# EAGLE design powerbrick_v1 (EAGLE 7.2.0)
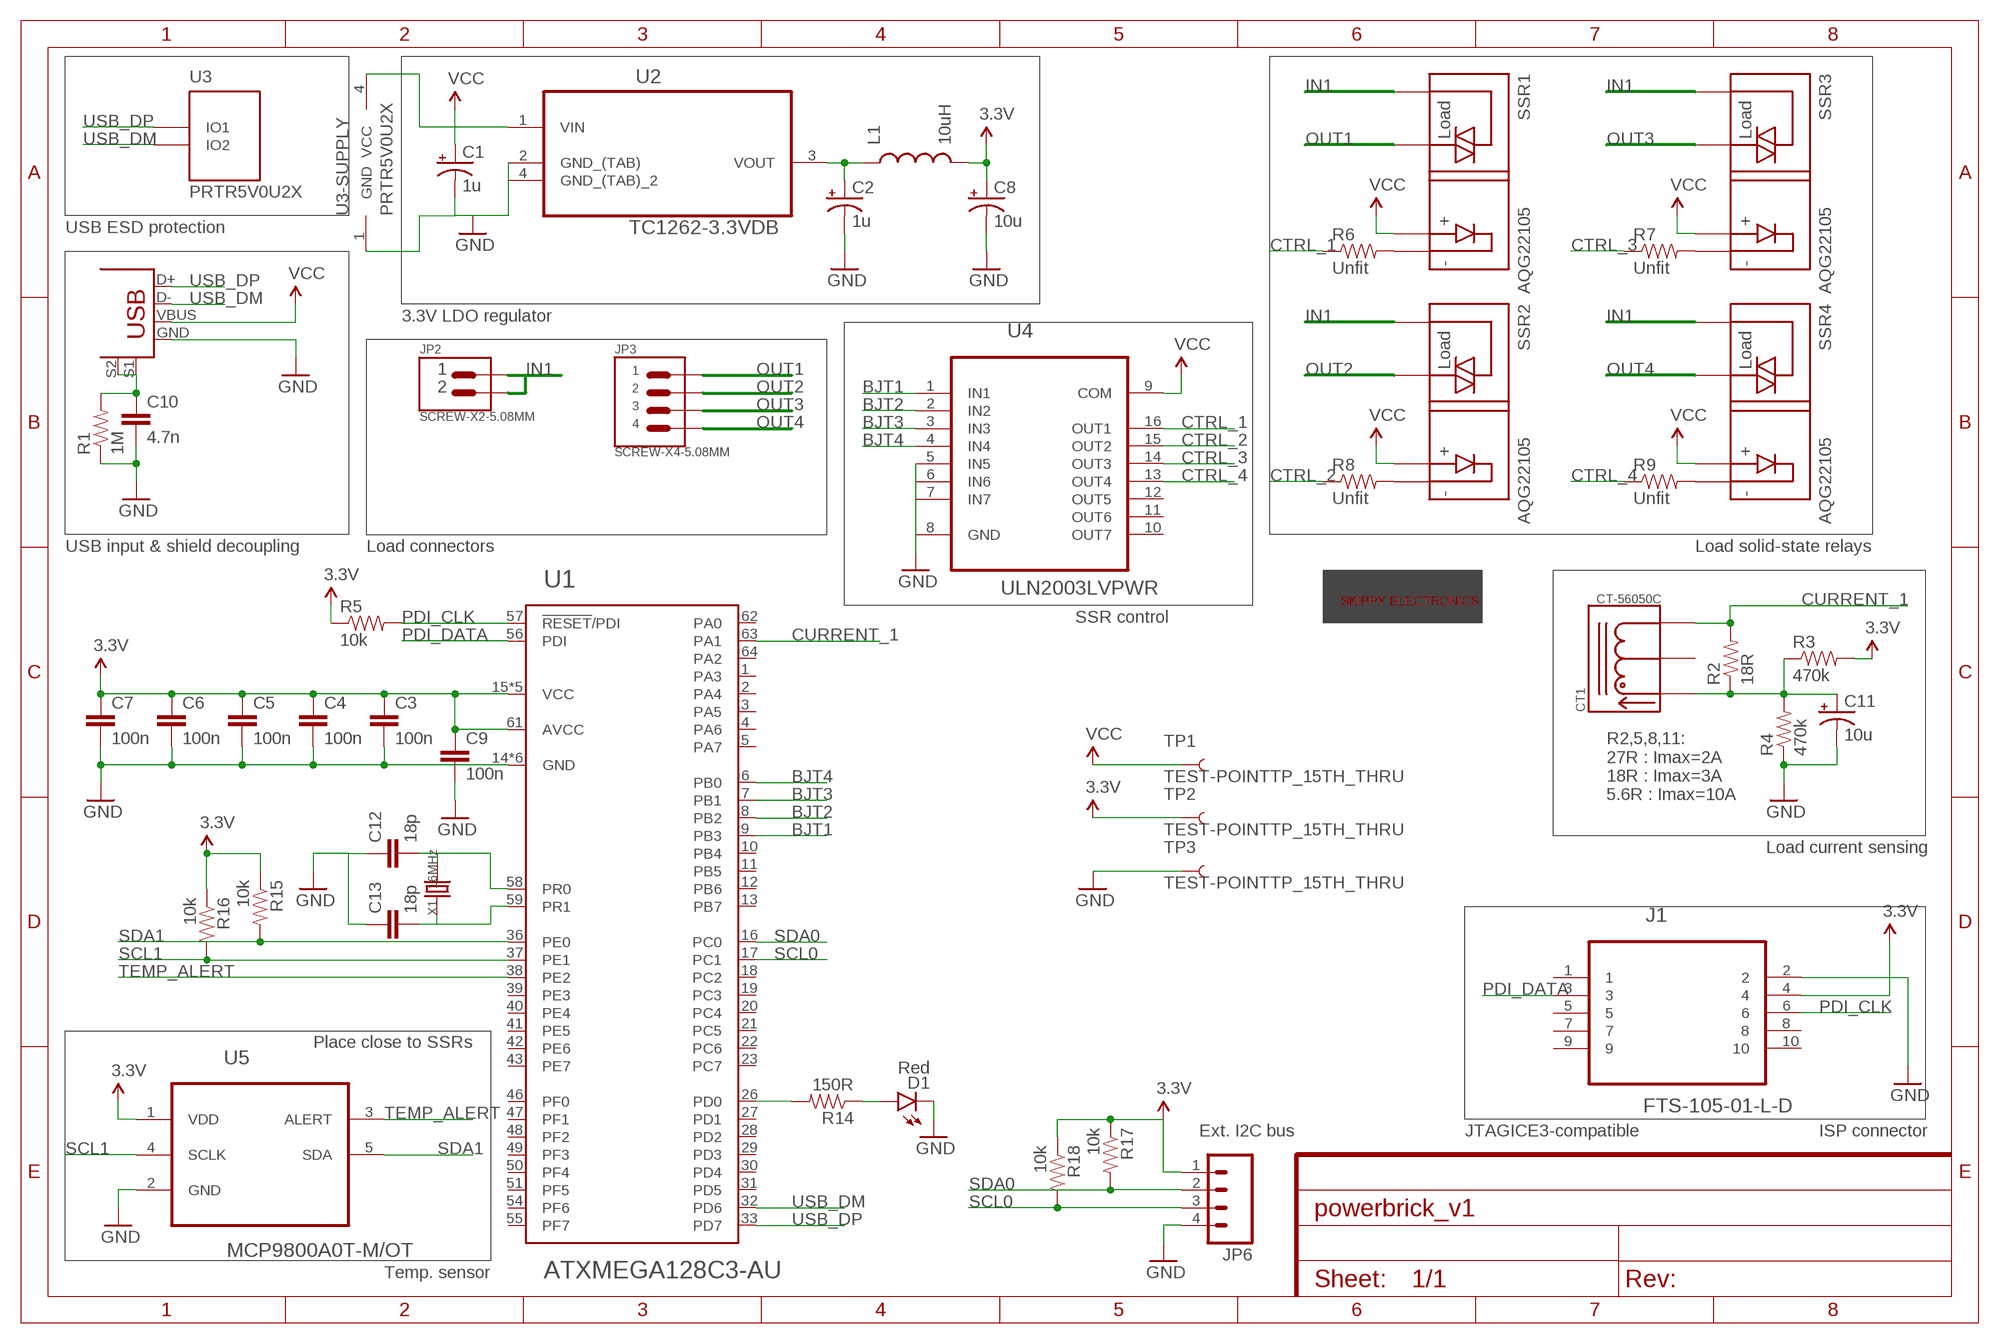
[diagram p0: schematic, sheet 1]
FRAME1 (FRAME-A4L): CNAME: Powerbrick; CREVISION: 1.0; DESIGNER: Christophe Huriaux

## Parts
C1  1u  CAP_POL1206-KIT  [EIA3216-KIT]
C2  1u  CAP_POL1206-KIT  [EIA3216-KIT]
C3  100n  CAP0805  [0805]
C4  100n  CAP0805  [0805]
C5  100n  CAP0805  [0805]
C6  100n  CAP0805  [0805]
C7  100n  CAP0805  [0805]
C8  10u  CAP_POL1206-KIT  [EIA3216-KIT]
C9  100n  CAP0805  [0805]
C10  4.7n  CAP0805  [0805]
C11  10u  CAP_POL1206-KIT  [EIA3216-KIT]
C12  18p  CAP0805  [0805]
C13  18p  CAP0805  [0805]
CT1  CT-56050C  [CT-56050C]
D1  Red  LED5MM  [LED5MM]
J1  FTS-105-01-L-D  [SAMTEC_FTS-105-01-L-D]
JP1  USB+SHIELD  [USB-B-PTH]
JP2  SCREW-X2-5.08MM  [1X02-5.08MM]
JP3  SCREW-X4-5.08MM  [1X04]
JP6  M04POLAR_LOCK  [MOLEX-1X4_LOCK]
L1  10uH  INDUCTORBOURNS_SRN6045  [SRN6045]
R1  1M  RESISTOR0805-RES  [0805]
R2  18R  RESISTOR2512  [R2512]
R3  470k  RESISTOR0805-RES  [0805]
R4  470k  RESISTOR0805-RES  [0805]
R5  10k  RESISTOR0805-RES  [0805]
R6  Unfit  RESISTOR0805-RES  [0805]
R7  Unfit  RESISTOR0805-RES  [0805]
R8  Unfit  RESISTOR0805-RES  [0805]
R9  Unfit  RESISTOR0805-RES  [0805]
R14  150R  RESISTOR0805-RES  [0805]
R15  10k  RESISTOR0805-RES  [0805]
R16  10k  RESISTOR0805-RES  [0805]
R17  10k  RESISTOR0805-RES  [0805]
R18  10k  RESISTOR0805-RES  [0805]
SSR1  AQG22105  [SSR-100-400-300]
SSR2  AQG22105  [SSR-100-400-300]
SSR3  AQG22105  [SSR-100-400-300]
SSR4  AQG22105  [SSR-100-400-300]
TP1  TEST-POINTTP_15TH_THRU  [TP_15TH]
TP2  TEST-POINTTP_15TH_THRU  [TP_15TH]
TP3  TEST-POINTTP_15TH_THRU  [TP_15TH]
U1  ATXMEGA128C3-AU  [TQFP-64A-64]
U2  TC1262-3.3VDB  [SOT230P700X180-4N]
U3  PRTR5V0U2X  [SOT-143B]
U4  ULN2003LVPWR  [SOP65P640X120-16N]
U5  MCP9800A0T-M/OT  [SOT95P280X145-5N]
U$2  SKIPPYTXT-PLC-10MM  [SKIPPYTXT-PLC-10MM]
X1  16MHz  CRYSTAL'HC49S'  [HC49S]

## Nets
3.3V: C3.1 C4.1 C5.1 C6.1 C7.1 C8.A(+) C9.1 J1.4 JP6.1 L1.2 R3.2 R5.1 R15.1 R16.1 R17.1 R18.1 TP2.P$1 U1.15(VCC) U1.25(VCC) U1.35(VCC) U1.45(VCC) U1.53(VCC) U1.61(AVCC) U5.1(VDD)
BJT1: U1.9(PB3) U4.1(IN1)
BJT2: U1.8(PB2) U4.2(IN2)
BJT3: U1.7(PB1) U4.3(IN3)
BJT4: U1.6(PB0) U4.4(IN4)
CTRL_1: R6.1 U4.16(OUT1)
CTRL_2: R8.1 U4.15(OUT2)
CTRL_3: R7.1 U4.14(OUT3)
CTRL_4: R9.1 U4.13(OUT4)
CURRENT_1: CT1.P$3 R2.2 U1.63(PA1)
GND: C1.C(-) C2.C(-) C3.2 C4.2 C5.2 C6.2 C7.2 C8.C(-) C9.2 C10.2 C11.C(-) C12.1 C13.1 D1.K(C) J1.2 JP1.GND JP6.4 R1.1 R4.1 TP3.P$1 U1.14(GND) U1.24(GND) U1.34(GND) U1.44(GND) U1.52(GND) U1.60(GND) U2.2(GND_(TAB)) U2.4(GND_(TAB)_2) U3.1(GND) U4.5(IN5) U4.6(IN6) U4.7(IN7) U4.8(GND) U5.2(GND)
IN1: JP2.P$1 JP2.P$2 SSR1.P$4 SSR2.P$4 SSR3.P$4 SSR4.P$4
N$1: C12.2 U1.58(PR0) X1.2
N$2: C2.A(+) L1.1 U2.3(VOUT)
N$3: C13.2 U1.59(PR1) X1.1
N$4: C11.A(+) CT1.P$1 R2.1 R3.1 R4.2
N$5: C10.1 JP1.S1 JP1.S2 R1.2
N$6: R6.2 SSR1.P$1
N$9: R7.2 SSR3.P$1
N$10: R9.2 SSR4.P$1
N$11: R14.2 U1.26(PD0)
N$12: D1.A R14.1
N$13: R8.2 SSR2.P$1
OUT1: JP3.P$1 SSR1.P$3
OUT2: JP3.P$2 SSR2.P$3
OUT3: JP3.P$3 SSR3.P$3
OUT4: JP3.P$4 SSR4.P$3
PDI_CLK: J1.6 R5.2 U1.57(!RESET!/PDI)
PDI_DATA: J1.3 U1.56(PDI)
SCL0: JP6.3 R18.2 U1.17(PC1)
SCL1: R16.2 U1.37(PE1) U5.4(SCLK)
SDA0: JP6.2 R17.2 U1.16(PC0)
SDA1: R15.2 U1.36(PE0) U5.5(SDA)
TEMP_ALERT: U1.38(PE2) U5.3(ALERT)
USB_DM: JP1.D- U1.32(PD6) U3.3(IO2)
USB_DP: JP1.D+ U1.33(PD7) U3.2(IO1)
VCC: C1.A(+) JP1.VBUS SSR1.P$2 SSR2.P$2 SSR3.P$2 SSR4.P$2 TP1.P$1 U2.1(VIN) U3.4(VCC) U4.9(COM)
Unconnected: CT1.P$2 J1.1 J1.5 J1.7 J1.8 J1.9 J1.10 U1.1(PA3) U1.2(PA4) U1.3(PA5) U1.4(PA6) U1.5(PA7) U1.10(PB4) U1.11(PB5) U1.12(PB6) U1.13(PB7) U1.18(PC2) U1.19(PC3) U1.20(PC4) U1.21(PC5) U1.22(PC6) U1.23(PC7) U1.27(PD1) U1.28(PD2) U1.29(PD3) U1.30(PD4) U1.31(PD5) U1.39(PE3) U1.40(PE4) U1.41(PE5) U1.42(PE6) U1.43(PE7) U1.46(PF0) U1.47(PF1) U1.48(PF2) U1.49(PF3) U1.50(PF4) U1.51(PF5) U1.54(PF6) U1.55(PF7) U1.62(PA0) U1.64(PA2) U4.10(OUT7) U4.11(OUT6) U4.12(OUT5)

## Notes on the sheet
- USB ESD protection
- 3.3V LDO regulator
- USB input & shield decoupling | Load connectors | Load solid-state relays
- SSR control
- R2,5,8,11:
  27R : Imax=2A
  18R : Imax=3A
  5.6R : Imax=10A
- Load current sensing
- Place close to SSRs
- Ext. I2C bus | JTAGICE3-compatible | ISP connector
- Temp. sensor

## Library data of the parts
C1 C2 = SparkFun-Capacitors:CAP_POL: Capacitor Polarized These are standard SMD and PTH capacitors. Normally 10uF, 47uF, and 100uF in electrolytic and tantalum varieties. Always verify the external diameter of the through hole cap, it varies with capacity, voltage, and manufacturer. The EIA devices should be standard.; OC_FARNELL: 1135123
C3-C7 C9 C10 C12 C13 = SparkFun-Capacitors:CAP: Capacitor Standard 0603 ceramic capacitor, and 0.1" leaded capacitor.
C8 C11 = SparkFun-Capacitors:CAP_POL: Capacitor Polarized These are standard SMD and PTH capacitors. Normally 10uF, 47uF, and 100uF in electrolytic and tantalum varieties. Always verify the external diameter of the through hole cap, it varies with capacity, voltage, and manufacturer. The EIA devices should be standard.
CT1 = Skippy-Discrete:CT-56050C; OC_FARNELL: 2291968
D1 = SparkFun-LED:LED: LEDs Standard schematic elements and footprints for 5mm, 3mm, 1206, and 0603 sized LEDs. 5mm - Spark Fun Electronics SKU : COM-00529 (and others); OC_FARNELL: 2112111
J1 = Skippy-Connectors:FTS-105-01-L-D; OCFARNELL: 1577743
JP1 = SparkFun-Connectors:USB+SHIELD: USB+Shield USB connector with shield pins connectable; OC_FARNELL: 1097897
JP2 = Skippy-Connectors:SCREW-X2-5.08MM; OC_FARNELL: 2315273
JP3 = Skippy-Connectors:SCREW-X4-5.08MM; OC_FARNELL: 2315275
JP6 = SparkFun-Connectors:M04: Header 4 Standard 4-pin 0.1" header. Use with straight break away headers (SKU : PRT-00116), right angle break away headers (PRT-00553), swiss pins (PRT-00743), machine pins (PRT-00117), and female headers (PRT-00115). Molex polarized connector foot print use with SKU : PRT-08231 with associated crimp pins and housings. 1MM SMD Version SKU: PRT-10208
L1 = SparkFun-Passives:INDUCTOR: Inductors Basic Inductor/Choke - 0603 and 1206. Footprints are not proven and vary greatly between part numbers. SRN6045- 33uH, 20% 1.4A SDR0403-560KL - 56uH, 10%, 500mA RMS/740mA peak; OC_FARNELL: 2061652; PROD_ID: NDUC-11627; VALUE: 33uH
R1 R3-R9 R14-R18 = SparkFun-Passives:RESISTOR: Resistor Basic schematic elements and footprints for 0603, 1206, and PTH resistors.
R2 = SparkFun-Passives:RESISTOR: Resistor Basic schematic elements and footprints for 0603, 1206, and PTH resistors.; OC_FARNELL: 1717969
SSR1-SSR4 = Skippy-Discrete:AQG22105; OC_FARNELL: 2095710
TP1-TP3 = SparkFun-Passives:TEST-POINT: Bare copper test points for troubleshooting or ICT
U1 = atmel-xmega:ATXMEGA128C3: 8/16-bit XMEGA C3 Microcontroller Features High-performance, low-power Atmel® AVR® XMEGA® 8/16-bit Microcontroller Nonvolatile program and data memories – 64K - 256KBytes of In-System Self-Programmable Flash – 4K - 8KBytes Boot Code Section with Independent Lock Bits – 2K - 4KBytes EEPROM – 4K - 16KBytes Internal SRAM Peripheral features – Four-channel event system – Five 16-bit timer/counters Four timer/counters with four output compare or input capture channels One timer/counter with two output compare or input capture channels High resolution extension on two timer/counters Advanced waveform extension (AWeX) on one timer/counter – One USB device interface USB 2.0 full speed (12Mbps) and low speed (1.5Mbps) device compliant 32 Endpoints with full configuration flexibility – Three USARTs with IrDA support for one USART – Two two-wire interfaces with dual address match (I2C and SMBus compatible) – Two serial peripheral interfaces (SPIs) – CRC-16 (CRC-CCITT) and CRC-32 (IEEE®802.3) generator – 16-bit real time counter (RTC) with separate oscillator – One sixteen-channel, 12-bit, 300ksps Analog to Digital Converter – Two Analog Comparators with window compare function, and current sources – External interrupts on all general purpose I/O pins – Programmable watchdog timer with separate on-chip ultra low power oscillator – QTouch® library support Capacitive touch buttons, sliders and wheels Special microcontroller features – Power-on reset and programmable brown-out detection – Internal and external clock options with PLL and prescaler – Programmable multilevel interrupt controller – Five sleep modes – Programming and debug interface PDI (program and debug interface) I/O and packages – 50 programmable I/O pins – 64-lead TQFP – 64-pad QFN Operating voltage – 1.6 – 3.6V Operating frequency – 0 – 12MHz from 1.6V – 0 – 32MHz from 2.7V; OC_FARNELL: 2353909
U2 = Skippy-IC:TC1262-3.3VDB: IC, 500mA Fixed Output CMOS LDO,3.3V,SOT-223, 3-lead; MPN: TC1262-3.3VDB; OC_FARNELL: 1852183; OC_NEWARK: 53R0370; PACKAGE: SOT-223-3; SUPPLIER: Microchip
U3 = NXPSemiconductors:PRTR5V0U2X?: I2C-Bus EDS Protection Ulta low capacitance double rail-to-rail ESD protection diode Documentation Datasheet <http://www.nxp.com/documents/data_sheet/PRTR5V0U2X.pdf> General Description Ultra low capacitance rail-to-rail ElectroStatic Discharge (ESD) protection diode in a small SOT143B Surface-Mounted Device (SMD) plastic package designed to protect two Hi-Speed data lines or high-frequency signal lines from the damage caused by ESD and other transients. PRTR5V0U2X incorporates two pairs of ultra low capacitance rail-to-rail diodes as well as an additional ESD protection diode to ensure signal line protection even if no supply voltage is available. Features ESD protection of two Hi-Speed data lines or high-frequency signal lines Ultra low input/output to ground capacitance: C(I/O-GND) = 1 pF ESD protection up to 8kV IEC 61000-4-2, level 4 (ESD) Very low clamping voltage due to an integrated additional ESD protection diode Very low reverse current Small SMD plastic package Applications USB 2.0 ports Digital Video Interface (DVI)/High Definition Multimedia Interface (HDMI) interfaces Mobile and cordless phones Personal Digital Assistants (PDA) Digital Cameras Wide Area Network (WAN) / Local Area Network (LAN) systems PCs, notebooks, printers, and other PC peripherals
U4 = Skippy-IC:ULN2003LVPWR: 7-Channel Relay and Inductive Load Sink Driver,TSSOP-16; OC_FARNELL: 2296010
U5 = Skippy-IC:MCP9800A0T-M/OT: Temperature Sensor; OC_FARNELL: 1439485
U$2 = skippy-logo:SKIPPYTXT-PLC-10MM
X1 = Discrete:CRYSTAL*: CRYSTAL

## Net classes
1 hv: width 3.81 mm, clearance 3.048 mm

## Board
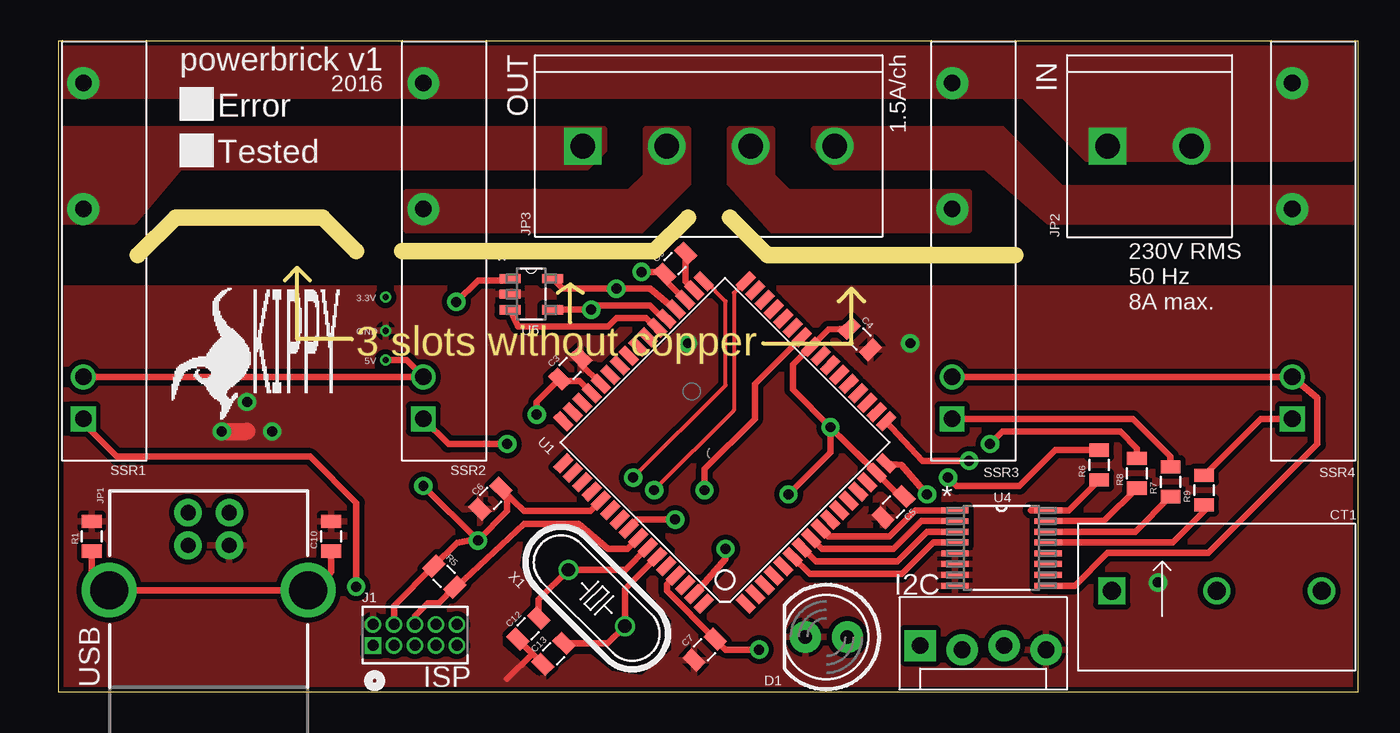
[diagram p1: board, top side]
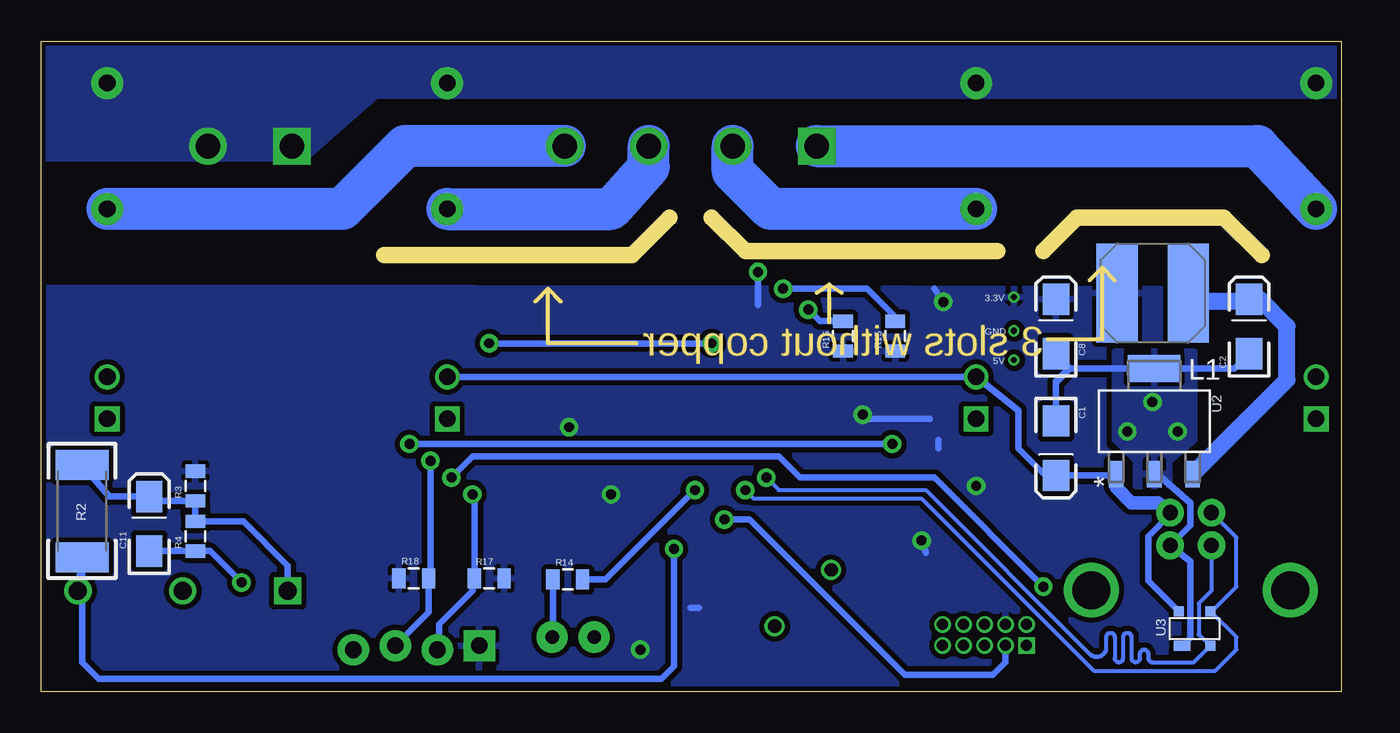
[diagram p2: board, bottom side, seen from below]

Size 78.66 x 39.36 mm. Coordinates in mm from the lower left corner, seen from the top.
Outline: 0,0 78.66,0 78.66,39.36 0,39.36 0,0
Copper layers (1*2*15*16): Top 0.035mm / dielectric 0.2mm / layer 2 0.0175mm / dielectric 1.1mm / layer 15 0.0175mm / dielectric 0.2mm / Bottom 0.035mm
Design rules "SeeedStudio_DRU_no_angle_20130527 *": minimum track width 6mil, minimum drill 12mil, track to track 6mil, track to pad 6mil, pad to pad 6mil, via to via 6mil, smd to smd 0mil, copper to edge 10mil, drill to drill 10mil, minimum pad ring 6mil, minimum via ring 10mil, stop-mask expansion 2mil, vias tented up to drill 25mil, thermal gap 10mil
Milling: 18 lines

### Footprints (pad centres in the part's own frame; a part is rotated, then mirrored left to right if it is on the bottom)
EIA3216-KIT = smd 1.9 x 1.6: A 1.65,0; C -1.65,0
0805 = smd 0.8 x 1.2: 1 -0.9,0; 2 0.9,0
CT-56050C = drill 1.1 square: P$1 -6.35,0 | drill 1.1: P$2 0,0; P$3 6.35,0
LED5MM = drill 0.813 pad 1.88: A -1.27,0; K 1.27,0
SAMTEC_FTS-105-01-L-D = drill 0.66 square: 1 -5.08,-1.27 | drill 0.66: 2 -5.08,0; 3 -3.81,-1.27; 4 -3.81,0; 5 -2.54,-1.27; 6 -2.54,0; 7 -1.27,-1.27; 8 -1.27,0; 9 0,-1.27; 10 0,0
USB-B-PTH = drill 0.914 pad 1.676: D+ 0,1.25; D- 1.981,1.25; GND 0,-1.25; VBUS 1.981,-1.25 | drill 2.286: S1 -2.718,-6.02; S2 -2.718,6.02
1X02-5.08MM = drill 1.5 square: P$1 -2.54,0 | drill 1.5: P$2 2.54,0
1X04 = drill 1.5 square: P$1 -7.62,0 | drill 1.5: P$2 -2.54,0; P$3 2.54,0; P$4 7.62,0
MOLEX-1X4_LOCK = drill 1.016 pad 1.88 square: 1 0,0.127 | drill 1.016 pad 1.88: 2 2.54,-0.127; 3 5.08,0.127; 4 7.62,-0.127
SRN6045 = smd 2.5 x 6: 1 -2.175,-0.175; 2 2.125,-0.175
R2512 = smd 1.8 x 3.2: 1 -2.8,0; 2 2.8,0
SSR-100-400-300 = drill 1 square: P$1 -10.16,0 | drill 1: P$2 -7.62,0 | drill 1 pad 1.93: P$3 2.54,0; P$4 10.16,0
TP_15TH = drill 0.381 pad 0.61: P$1 0,0
TQFP-64A-64 = smd 1.194 x 0.559: 1 -7.8,6; 2 -7.8,5.2; 3 -7.8,4.4; 4 -7.8,3.6; 5 -7.8,2.8; 6 -7.8,2; 7 -7.8,1.2; 8 -7.8,0.4; 9 -7.8,-0.4; 10 -7.8,-1.2; 11 -7.8,-2; 12 -7.8,-2.8; 13 -7.8,-3.6; 14 -7.8,-4.4; 15 -7.8,-5.2; 16 -7.8,-6; 33 7.8,-6; 34 7.8,-5.2; 35 7.8,-4.4; 36 7.8,-3.6; 37 7.8,-2.8; 38 7.8,-2; 39 7.8,-1.2; 40 7.8,-0.4; 41 7.8,0.4; 42 7.8,1.2; 43 7.8,2; 44 7.8,2.8; 45 7.8,3.6; 46 7.8,4.4; 47 7.8,5.2; 48 7.8,6 | smd 0.559 x 1.194: 17 -6,-7.8; 18 -5.2,-7.8; 19 -4.4,-7.8; 20 -3.6,-7.8; 21 -2.8,-7.8; 22 -2,-7.8; 23 -1.2,-7.8; 24 -0.4,-7.8; 25 0.4,-7.8; 26 1.2,-7.8; 27 2,-7.8; 28 2.8,-7.8; 29 3.6,-7.8; 30 4.4,-7.8; 31 5.2,-7.8; 32 6,-7.8; 49 6,7.8; 50 5.2,7.8; 51 4.4,7.8; 52 3.6,7.8; 53 2.8,7.8; 54 2,7.8; 55 1.2,7.8; 56 0.4,7.8; 57 -0.4,7.8; 58 -1.2,7.8; 59 -2,7.8; 60 -2.8,7.8; 61 -3.6,7.8; 62 -4.4,7.8; 63 -5.2,7.8; 64 -6,7.8
SOT230P700X180-4N = smd 1.626 x 0.889: 1 -3.2,2.311; 2 -3.2,0; 3 -3.2,-2.311 | smd 1.626 x 3.175: 4 3.2,0
SOT-143B = smd 1 x 0.6: 1 -0.75,-1.05 | smd 0.6 x 0.6: 2 0.95,-1.05; 3 0.95,1.05; 4 -0.95,1.05
SOP65P640X120-16N = smd 1.651 x 0.356: 1 -2.819,2.286; 2 -2.819,1.626; 3 -2.819,0.965; 4 -2.819,0.33; 5 -2.819,-0.33; 6 -2.819,-0.965; 7 -2.819,-1.626; 8 -2.819,-2.286; 9 2.819,-2.286; 10 2.819,-1.626; 11 2.819,-0.965; 12 2.819,-0.33; 13 2.819,0.33; 14 2.819,0.965; 15 2.819,1.626; 16 2.819,2.286
SOT95P280X145-5N = smd 1.27 x 0.559: 1 -1.295,0.94; 2 -1.295,0; 3 -1.295,-0.94; 4 1.295,-0.94; 5 1.295,0.94
HC49S = drill 0.813: 1 -2.413,0; 2 2.413,0

### Placement (x,y rotation side)
C1  17.27,14.73 270 bottom
C2  5.59,22.1 90 bottom
C3  30.99,19.56 45 top
C4  48.51,21.34 315 top
C5  50.55,11.18 225 top
C6  26.16,11.68 225 top
C7  39.12,2.54 225 top
C8  17.27,22.1 90 bottom
C9  37.34,25.91 45 top
C10  16.51,9.4 90 top
C11  72.14,10.16 90 bottom
C12  28.45,3.81 45 top
C13  29.97,2.29 45 top
CT1  70.1,6.1 0 top
D1  46.48,3.3 180 top
J1  24.13,4.06 0 top
JP1  9.11,8.85 90 top
JP2  66.04,33.02 0 top
JP3  39.37,33.02 0 top
JP6  52.16,2.66 0 top
L1  11.44,23.95 180 bottom
R1  2.03,9.4 270 top
R2  76.2,10.92 270 bottom
R3  69.34,12.45 90 bottom
R4  69.34,9.4 90 bottom
R5  23.37,6.96 315 top
R6  62.99,13.72 90 top
R7  67.31,12.7 90 top
R8  65.28,13.21 90 top
R9  69.34,12.19 90 top
R14  46.81,6.78 0 bottom
R15  27,21.52 90 bottom
R16  30.15,21.52 90 bottom
R17  51.56,6.86 180 bottom
R18  56.13,6.86 0 bottom
SSR1  1.52,26.67 90 top
SSR2  22.1,26.67 90 top
SSR3  54.1,26.67 90 top
SSR4  74.68,26.67 90 top
TP1  19.81,20.07 0 top
TP2  19.81,23.88 0 top
TP3  19.81,21.84 0 top
U1  40.34,15.08 135 top
U2  11.32,16.36 90 bottom
U3  8.89,3.81 0 bottom
U4  57.08,8.69 0 top
U5  28.63,24.06 0 top
U$2  6.93,16.53 0 top
X1  32.59,5.66 135 top

### Tracks (layer width: path | path; a pad name or v marks a point on that pad's centre or on a via)
3.3V  (via drill 0.6)
  Top 0.406: C4.1 46.61,21.92 U1.25 45.52,20.88 44.45,19.81 44.45,18.29 v46.74,16 | v46.74,16 48.81,13.97 U1.15 49.53,13.21 50.29,12.45 50.8,11.94 C5.1 50.93,11.81 v46.74,16 | U1.61 36.83,6.48 36.83,6.1 C7.1 | C7.1 | C7.1 40.39,2.54 v42.42,2.54 | v35.31,25.4 36.58,25.4 C9.1 36.7,24.95 U1.35 | U1.45 31.54,18.8 30.48,18.8 C3.1 28.96,17.53 v28.96,16.76 | J1.4 20.32,5.19 R5.1 24.13,9 24.89,9.14 v25.4,9.14 | U1.53 32.22,10.92 28.19,10.92 27.56,11.56 27.18,11.94 | 27.18,11.94 C6.1 | U5.1 27.23,24.89 25.4,24.89 v24.09,23.58 | v25.4,9.14 27.18,10.92 27.18,11.94 | v22.1,12.45 v25.4,9.14 | v46.74,16 46.74,14.48 v44.2,11.94
  Bottom 0.406: v28.96,16.76 28.96,16.51 24.89,16.51 | 38.86,5.08 39.37,5.08 | v42.42,2.54 42.67,2.54 | v25.4,9.14 25.15,8.38 | v35.31,25.4 35.29,23.4 | v24.09,23.58 24.64,24.38 | 24.38,15.24 24.38,14.73 | v44.2,11.94 44.45,11.68
  pour Bottom (isolate 0.305, rank 6): 0,0 78.74,0 78.44,24.45 0,24.35
BJT1
  Top 0.406: U1.9 46.59,9.4 50.29,9.4 51.87,10.98 U4.1
BJT2
  Top 0.406: U1.8 46.22,8.64 50.55,8.64 52.23,10.32 U4.2
BJT3
  Top 0.406: U1.7 45.85,7.87 50.8,7.87 52.58,9.66 U4.3
BJT4
  Top 0.406: U1.6 45.48,7.11 51.05,7.11 52.96,9.02 U4.4
CTRL_1
  Top 0.406: 58.87,10.98 U4.16 61.15,10.98 R6.1
CTRL_2
  Top 0.406: U4.15 63.29,10.32 R8.1
CTRL_3
  Top 0.406: U4.14 65.17,9.66 R7.1
CTRL_4
  Top 0.406: U4.13 67.44,9.02 69.34,10.92 R9.1
CURRENT_1  (via drill 0.6)
  Top 0.406: v40.39,8.64 40.39,8.03 U1.63
  Bottom 0.406: CT1.P$3 R2.2 76.2,1.78 75.18,0.76 41.15,0.76 40.39,1.52 v40.39,8.64
GND  (via drill 0.6)
  Top 0.406: v66.55,6.6 66.55,6.35 | C13.1 C12.1 28.7,2.29 27.18,0.76 | U1.44 31.62,19.84 C3.2 | U1.34 37.97,24.8 C9.2
  Top 1.016: v9.91,15.75 11.43,15.75
  Bottom 0.406: U3.1 9.14,3.26 9.14,7.87 10.38,8.85 JP1.GND 9.14,10.07 9.14,11.43 11.13,13.16 U2.2 | C2.C 6.48,19.56 U2.4 16.38,19.56 | 16.38,19.56 C8.C | 16.38,19.56 17.27,18.67 C1.C 17.27,18.8 16.51,19.56 11.43,19.56 | C11.C 69.35,8.51 | 69.35,8.51 R4.1 | 69.35,8.51 68.45,8.51 v66.55,6.6 | v38.1,21.08 v51.56,21.08
  other vias: 12.95,15.75 11.43,17.53
  pour Top (isolate 0.305, rank 6): 0,0 78.74,0 78.49,24.38 0,24.38
  cutout Top (isolate 0.254, no thermals): 36.07,9.65 34.54,8.13 33.53,8.13 31.24,10.16 29.46,10.16 28.19,9.14 27.94,7.62 28.7,6.1 28.7,5.33 26.92,3.56 26.92,2.79 28.96,1.02 29.72,1.02 31.24,2.29 32.26,2.29 33.53,1.27 35.31,1.02 37.08,2.54 37.08,4.32 35.56,6.1 35.56,6.86 37.34,8.64 36.32,9.65
  pour Bottom: 10.41,12.45 12.45,12.45 12.45,13.97 13.72,15.24 13.72,20.57 8.89,20.57 8.89,15.24 10.41,13.97
IN1
  pour Bottom (no thermals): 0.25,39.12 0.25,36.07 58.42,36.07 62.74,32.26 78.49,32.26 78.49,39.12
  pour Top (no thermals): 0.25,38.86 0.25,36.07 58.42,36.07 62.23,32.26 78.23,32.26 78.23,39.12 0.51,39.12
N$1
  Top 0.406: U1.58 34.32,7.37 X1.2 29.08,5.57 C12.2
N$2
  Bottom 0.406: U2.3 8.89,13.28 | 8.89,23.62 9.27,24 L1.1
  Bottom 1.016: 8.89,13.28 3.3,18.87 3.3,22.1 4.95,23.75 C2.A 5.71,23.62 8.89,23.62
N$3
  Top 0.406: U1.59 34.29,6.21 X1.1 33.26,2.92 C13.2
N$4
  Bottom 0.406: CT1.P$1 63.75,7.62 66.43,10.3 R4.2 R3.1 71.87,11.55 C11.A 74.54,11.81 R2.1
N$5
  Top 0.406: R1.2 2.03,7.19 JP1.S2 JP1.S1 16.51,7.26 C10.1
N$6  (via drill 0.6)
  Top 0.406: SSR1.P$1 1.52,16.26 3.56,14.22 15.24,14.22 18.03,11.43 v18.03,6.35 | R6.2 60.34,14.62 58.17,12.45 54.36,12.45 v53.85,12.95
  Bottom 0.406: v53.85,12.95 52.58,14.22 34.04,14.22 32.77,12.95 24.64,12.95 v18.03,6.35
N$9
  Top 0.406: R7.2 67.31,14.22 65.02,16.51 SSR3.P$1
N$10
  Top 0.406: R9.2 72.76,16.51 SSR4.P$1
N$11  (via drill 0.6)
  Top 0.406: v39.12,12.19 39.12,13.46 42.16,16.51 42.16,18.61 U1.26
  Bottom 0.406: R14.2 44.52,6.78 v39.12,12.19
N$12
  Bottom 0.406: D1.A 47.71,3.34 R14.1
N$13  (via drill 0.6)
  Top 0.406: SSR2.P$1 23.62,14.99 v27.18,14.99 | R8.2 65.28,14.73 64.26,15.75 57.15,15.75 v56.39,14.99
  Bottom 0.406: v56.39,14.99 v27.18,14.99
OUT1
  Bottom 2.54: JP3.P$1 5.08,33.02 SSR1.P$3
  pour Top (no thermals): 33.02,34.04 33.02,32.77 32,31.75 7.37,31.75 4.57,28.45 0.25,28.45 0.25,34.04
OUT2
  Bottom 2.54: SSR2.P$3 34.54,29.21 36.83,31.5 JP3.P$2
  pour Top (no thermals): 21.08,30.23 34.54,30.23 35.56,31.24 35.56,34.04 38.1,34.04 38.1,30.73 35.31,27.94 21.08,27.94
OUT3
  Bottom 2.54: SSR3.P$3 44.2,29.21 41.91,31.75 JP3.P$3
  pour Top (no thermals): 40.64,34.04 43.18,34.04 43.18,31.24 44.2,30.23 55.12,30.23 55.12,27.94 43.18,27.94 40.64,30.73
OUT4
  Bottom 2.54: JP3.P$4 56.64,33.02 60.45,29.21 SSR4.P$3
  pour Top (no thermals): 45.72,34.04 57.15,34.04 60.71,30.48 78.49,30.48 78.49,28.45 59.94,28.45 56.13,31.75 46.99,31.75 45.72,33.02
PDI_CLK
  Top 0.406: J1.6 21.59,4.57 22.35,5.33 23.01,5.33 R5.2 24.11,6.33 28.19,10.16 31.5,10.16 33.27,8.64 34.46,8.64 U1.57
PDI_DATA  (via drill 0.6)
  Top 0.406: v37.34,10.41 35.05,10.41 34.54,9.9 U1.56
  Bottom 0.406: J1.3 20.32,1.78 21.08,1.02 26.42,1.02 35.81,10.41 v37.34,10.41
SCL0  (via drill 0.6)
  Top 0.406: U1.17 52.28,13.97 v55.12,13.97
  Bottom 0.406: 55.21,13.88 v55.12,13.97 55.12,6.97 R18.2 55.23,4.79 JP6.3
SCL1  (via drill 0.6)
  Top 0.406: 36.8,22.63 U1.37 36.6,22.58 35.81,23.37 32.51,23.37 v32.26,23.11 U5.4
  Bottom 0.406: v32.26,23.11 31.56,22.42 R16.2
SDA0  (via drill 0.6)
  Top 0.406: U1.16 51.02,13.72 v52.58,11.94
  Bottom 0.406: v52.58,11.94 52.42,11.85 52.46,11.89 R17.2 52.58,6.1 54.61,4.06 54.61,2.62 JP6.2
SDA1  (via drill 0.6)
  Top 0.406: U1.36 37.31,23.14 35.81,24.38 v33.78,24.38 30.53,24.38 U5.5
  Bottom 0.406: v33.78,24.38 28.7,24.38 27,22.68 R15.2
TEMP_ALERT
  Top 0.254: U1.38 36.15,22.1 36.07,22.1
  Top 0.406: U5.3 27.84,22.1 33.27,22.1 33.78,22.61 35.56,22.61 36.07,22.1 36.32,21.84 | 36.15,22.01 U1.38
USB_DM  (via drill 0.6)
  Top 0.254: U1.32 40.89,24.12 40.89,17.02 v36.07,12.19
  Bottom 0.254: JP1.D- 6.35,9.32 6.35,6.35 7.84,4.86 U3.3 7.91,4.83 6.35,3.3 6.35,2.54 7.62,1.27 14.99,1.27 25.4,11.68 35.56,11.68 v36.07,12.19
USB_DP  (via drill 0.6)
  Top 0.254: v34.8,12.95 40.39,18.54 40.39,23.62 39.17,24.84 U1.33
  Bottom 0.254: JP1.D+ 7.86,6.11 8.64,5.33 8.64,3.46 U3.2 8.92,1.78 11.43,1.78 arc90 11.68,2.03 11.68,2.29 arc-180 12.19,2.29 12.19,2.03 arc180 12.7,2.03 12.7,3.3 arc-180 13.21,3.3 13.21,2.03 arc180 13.72,2.03 13.72,3.3 arc-180 14.22,3.3 14.22,2.54 arc118 15.24,2.29 25.15,12.19 34.04,12.19 v34.8,12.95
VCC
  Top 0.406: SSR1.P$2 SSR2.P$2 21.08,20.07 TP1.P$1 | SSR3.P$2 SSR4.P$2 76.2,17.78 76.2,14.99 69.6,8.38 63.5,8.38 61.52,6.41 U4.9
  Bottom 0.406: U3.4 11.68,6.7 11.68,9.4 10.25,10.83 JP1.VBUS | 13.63,12.36 U2.1 13.71,13.08 C1.A 17.91,13.08 19.56,14.73 19.56,17.02 SSR2.P$2 SSR3.P$2
  Bottom 0.813: 10.25,10.83 11.1,11.43 12.7,11.43 13.63,12.36

### Text on the board
tPlace: Error | 1.5A/ch | Tested | 3.3V | 230V RMS / 50 Hz / 8A max. | GND | 5V
bPlace: 3.3V | GND | 5V
tNames: powerbrick v1 | 2016 | IN | OUT | SSR1 | SSR2 | SSR3 | SSR4 | I2C | USB | ISP
Milling: 3 slots without copper